# Altium schematic sheet Connectors.SchDoc
size Letter; CompanyName: Ploopy Corporation; Organization: Ploopy Corporation; Address1: 137-1140 Burnhamthorpe Road W; Address2: Mississauga; Address3: Ontario; Address4: Canada L5C 0A3; DocumentNumber: 3; Revision: R1.001; SheetNumber: 3; SheetTotal: 8
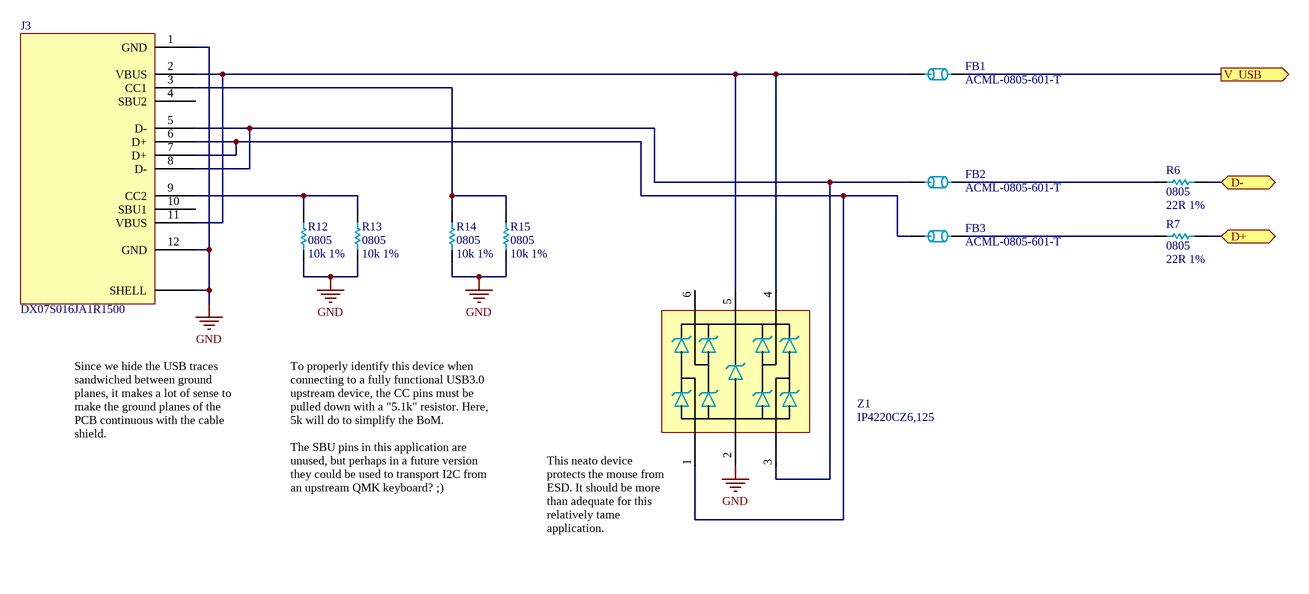
[diagram p0: Connectors.SchDoc]

## Parts
FB1  ACML-0805-601-T  [0805]
FB2  ACML-0805-601-T  [0805]
FB3  ACML-0805-601-T  [0805]
J3  DX07S016JA1R1500  [DX07S016JA1R1500]
R6  0805  value 22R 1%  [0805]
R7  0805  value 22R 1%  [0805]
R12  0805  value 10k 1%  [0805]
R13  0805  value 10k 1%  [0805]
R14  0805  value 10k 1%  [0805]
R15  0805  value 10k 1%  [0805]
Z1  IP4220CZ6,125  [PESD3V3S4UD - SOT95P275X110-6N]

## Ports
D+ (bidir), D- (bidir), V_USB (out)

## Nets
GND: J3.1(GND) J3.12(GND) J3.SHELL R12.1 R13.1 R14.1 R15.1 Z1.2
D+: R7.2 ; port D+
D-: R6.2 ; port D-
V_USB: FB1.2 ; port V_USB
NetFB1_1: FB1.1 J3.2(VBUS) J3.11(VBUS) Z1.4 Z1.5
NetFB2_1: FB2.1 J3.5(D-) J3.8(D-) Z1.3
NetFB2_2: FB2.2 R6.1
NetFB3_1: FB3.1 J3.6(D+) J3.7(D+) Z1.1
NetFB3_2: FB3.2 R7.1
NetJ3_3: J3.3(CC1) R14.2 R15.2
NetJ3_9: J3.9(CC2) R12.2 R13.2

Not connected (* = marked no-connect by the designer): J3 4(SBU2) 10(SBU1); Z1 6

## Notes on the sheet
- Since we hide the USB traces sandwiched between ground planes, it makes a lot of sense to make the ground planes of the PCB continuous with the cable shield.
- To properly identify this device when connecting to a fully functional USB3.0 upstream device, the CC pins must be pulled down with a "5.1k" resistor. Here, 5k will do to simplify the BoM.
  The SBU pins in this application are unused, but perhaps in a future version they could be used to transport I2C from an upstream QMK keyboard? ;)
- (near Z1) This neato device protects the mouse from ESD. It should be more than adequate for this relatively tame application.
- Copyright Ploopy Corporation 2021
- Licensed under the CERN-OHL-S v2
- http://ohwr.org/cernohl
- Title:
- PCB:
- Version:
- Ploopy Corporation
- Mississauga ON L5C 0A3
- 137-1140 Burnhamthorpe Road W
- Date:
- Time:
- Sheet
- of
- Canada

## Library data of the parts
FB1-FB3 = ACML-0805-601-T: FERRITE BEAD 600 OHM 0805 1LN; PNP-Nzl: 2; PNP-dx: 0; PNP-X: 2.00; PNP-Y: 1.25; PNP-Thk: 0.55; PNP-Lv: 1; PNP-TS: 70; PNP-Type: chi; PNP-FeedType: Tape; PNP-TapeWidth: 8; PNP-dy: 0; PNP-Pt: 0; PNP-W: 0; PNP-Level: 1; PNP-Voff: 0; PNP-PlacePriority: 1; PNP-A: 0; PNP-TapeIndex: 1; PNP-da: 0; Supplier 1: Digi-Key; Supplier Part Number 1: 535-12556-1-ND
J3 = DX07S016JA1R1500: USB-C (USB TYPE-C) USB 2.0 Receptacle Connector 24 (16+8 Dummy) Position Surface Mount, Right Angle; Through Hole; Supplier 1: Digi-Key; Supplier 2: Mouser; Supplier Part Number 1: 670-DX07S016JA1R1500CT-ND; Supplier Part Number 2: 656-DX07S016JA1R1500
R6 R7 = Res 22R 1% 0805: Chip resistor; PNP-Nzl: 2; PNP-dx: 0; PNP-X: 2.00; PNP-Y: 1.25; PNP-Thk: 0.55; PNP-Lv: 1; PNP-TS: 70; PNP-Type: chi; PNP-FeedType: Tape; PNP-TapeWidth: 8; PNP-dy: 0; PNP-Pt: 0; PNP-W: 0; PNP-Level: 1; PNP-Voff: 0; PNP-PlacePriority: 1; PNP-A: 0; PNP-TapeIndex: 1; PNP-da: 0; Supplier 1: Digi-Key; Supplier 2: Arrow; Supplier Part Number 1: RMCF0805FT22R0CT-ND; Supplier Part Number 2: RMCF0805FT22R0
R12-R15 = Res 10k 1% 0805: Chip resistor; Supplier 1: Digi-Key; Supplier Part Number 1: RMCF0805FT10K0TR-ND
Z1 = IP4220CZ6,125: TVS DIODE 5.5V 6TSOP (Low capacitance, USB); PNP-Nzl: 2; PNP-dx: 0; PNP-X: 2.9; PNP-Y: 1.3; PNP-A: 270; PNP-Thk: 1; PNP-Lv: 26; PNP-TS: 90; PNP-Type: CHP; PNP-FeedType: Tape; PNP-TapeWidth: 8; PNP-PlacePriority: 3; PNP-dy: 0; PNP-Pt: 0; PNP-W: 0; PNP-Level: 1; PNP-Voff: 0; PNP-TapeIndex: 1; PNP-da: 0